# Altium schematic sheet CAN.SchDoc
size A; SheetNumber: 2; SheetTotal: 5
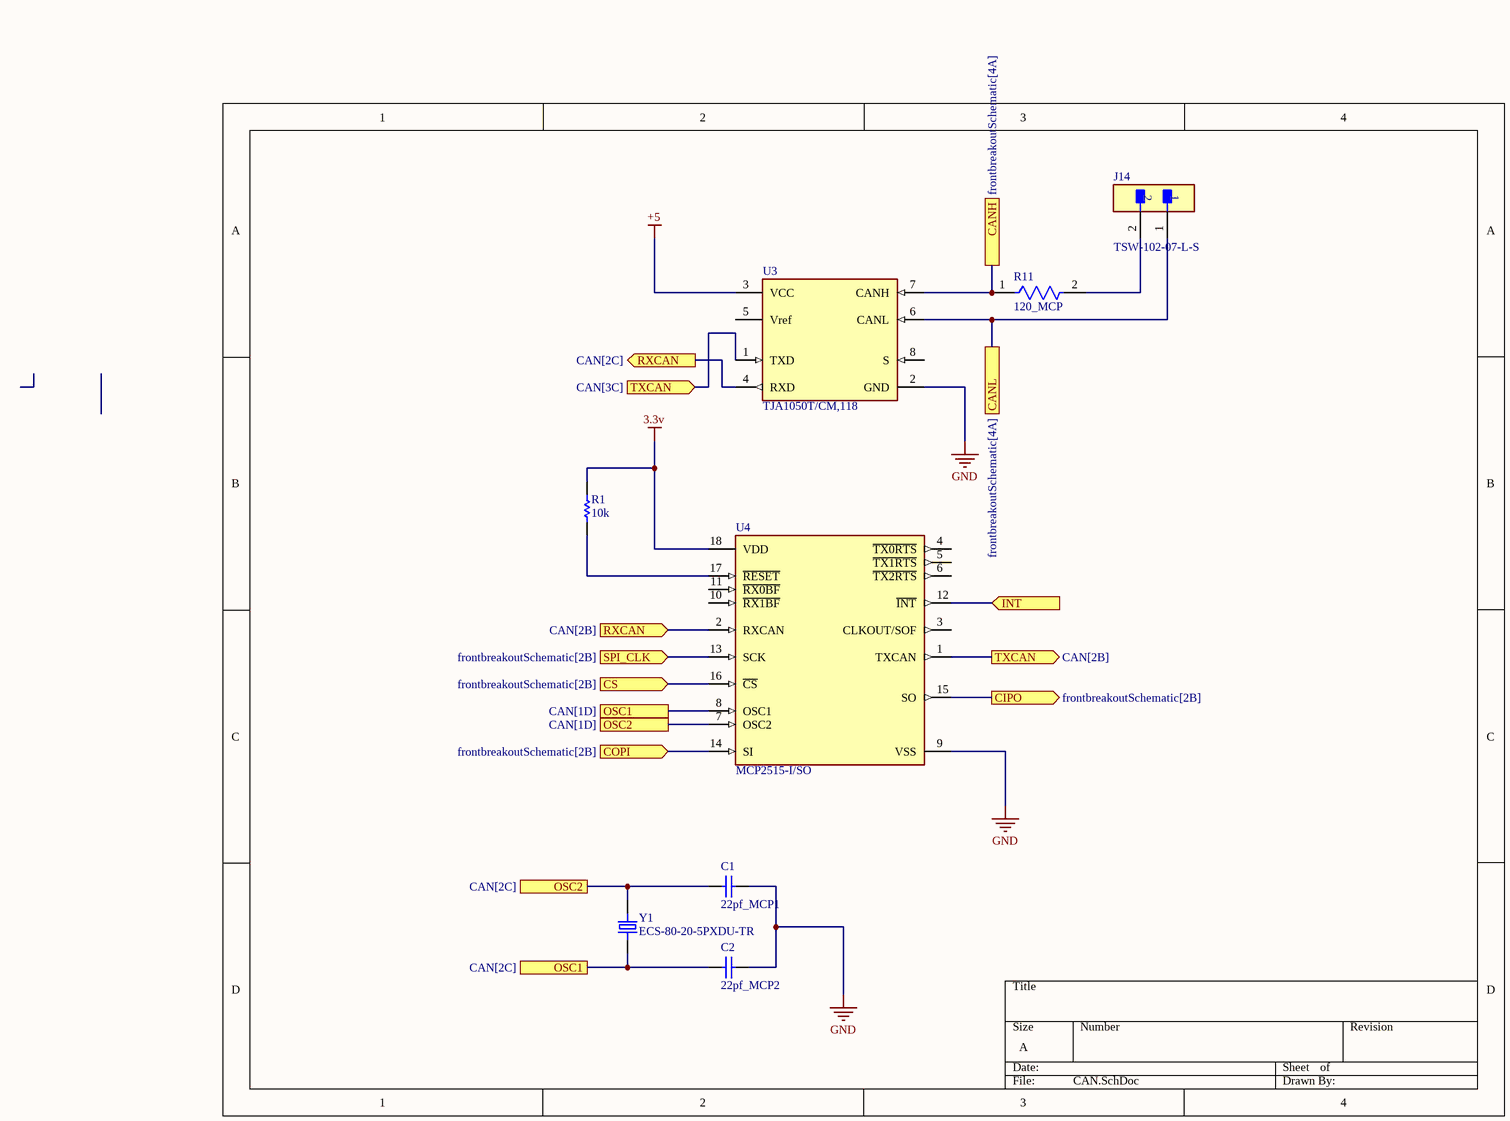
[diagram p0: CAN.SchDoc]

## Parts
C1  22pf_MCP1  [CAPC2013X145X50NL20T20]
C2  22pf_MCP2  [CAPC2013X145X50NL20T20]
J14  TSW-102-07-L-S  [FP-TSW-102-07-L-S-MFG]
R1  10k  [RESC3116X65X50NL20T20]
R11  120_MCP  [FP-CRCW0805-e3-IPC_C]
U3  TJA1050T/CM,118  [FP-SOT96-1-IPC_A]
U4  MCP2515-I/SO  [FP-C04-051-MFG]
Y1  ECS-80-20-5PXDU-TR  [XTAL_ECS-80-20-5PXDU-TR]

## Ports
CANH (see frontbreakoutSchematic[4A]), CANL (see frontbreakoutSchematic[4A]), CIPO (out, see frontbreakoutSchematic[2B]), COPI (in, see frontbreakoutSchematic[2B]), CS (in, see frontbreakoutSchematic[2B]), INT (in), OSC1 (see CAN[1D]), OSC1 (see CAN[2C]), OSC2 (see CAN[1D]), OSC2 (see CAN[2C]), RXCAN (in, see CAN[2B]), RXCAN (out, see CAN[2C]), SPI_CLK (in, see frontbreakoutSchematic[2B]), TXCAN (in, see CAN[3C]), TXCAN (out, see CAN[2B])

## Nets
3.3v: R1.2 U4.18(VDD)
+5: U3.3(VCC)
GND: C1.2 C2.2 U3.2(GND) U4.9(VSS)
CANH: R11.1 U3.7(CANH) ; port CANH
CANL: J14.1 U3.6(CANL) ; port CANL
CIPO: U4.15(SO) ; port CIPO
COPI: U4.14(SI) ; port COPI
CS: U4.16(~{CS}) ; port CS
INT: U4.12(~{INT}) ; port INT
OSC1: C2.1 U4.8(OSC1) Y1.1 ; port OSC1
OSC2: C1.1 U4.7(OSC2) Y1.2 ; port OSC2
RXCAN: U3.4(RXD) U4.2(RXCAN) ; port RXCAN
SPI_CLK: U4.13(SCK) ; port SPI_CLK
TXCAN: U3.1(TXD) U4.1(TXCAN) ; port TXCAN
NetJ14_2: J14.2 R11.2
NetR1_1: R1.1 U4.17(~{RESET})

Not connected (* = marked no-connect by the designer): U3 5(Vref) 8(S); U4 3(CLKOUT/SOF) 4(~{TX0RTS}) 5(~{TX1RTS}) 6(~{TX2RTS}) 10(~{RX1BF}) 11(~{RX0BF})

## Library data of the parts
C1 C2 = CMP-1036-01227-2: Manufacturer: Vitramon; Part Number: VJ0805A220GXXCW1BC
J14 = CMP-02766-001428-1: CONN HEADER VERT 2POS 2.54MM; Voltage Rating: 550V; Current Rating: 7.6A; Gender: Male; Number of Contacts: 2; Connector Type: Male Pin; Radiation Hardening: No; Orientation: Straight; Contact Plating: Gold; Max Operating Temperature: 125°C; Mount: Through Hole; Package Quantity: 1; Number of Rows: 1; Housing Material: Polyester; RoHS Compliant: Yes; Length: 5.08mm; Max Voltage Rating (AC): 550V; Pitch: 2.54mm; Packaging: Bulk; Depth: 2.54mm; Termination: Solder; Min Operating Temperature: -55°C; Housing Color: Black; Lead Free: Lead Free; Color: Black; Number of Positions: 2; Width: 2.54mm; Max Current Rating: 7.6A; REACH SVHC: No SVHC; Contact Material: Bronze; Contact Mating Length: 0.23inch; Series: TSW; Contact Type: Male Pin
R1 = CMP-2003-04883-1: CRCW120610K0FKEAHP; Manufacturer: Vishay Dale; Part Number: CRCW120610K0FKEAHP
R11 = CMP-02407-009256-1: RES Thick Film, 4.02Ω, 1%, 0.125W, 200ppm/°C, 0805; Resistance: 4.02R; Power Rating: 125mW; Voltage Rating: 150V; Features: Automotive AEC-Q200; Weight: 0.000194oz; Height: 0.02inch; Case Code (Metric): 2012; Composition: Thick Film; Temperature Coefficient: 200ppm/°C; Case/Package: 0805; Min Operating Temperature: -55°C; Width: 0.049inch; Contact Plating: Tin; Packaging: Tape and Reel; Tolerance: 1%; Length: 0.079inch; Lead Free: Lead Free; Case Code (Imperial): 0805; Package Quantity: 5000; Radiation Hardening: No; Max Operating Temperature: 155°C; Number of Terminations: 2; Max Power Dissipation: 125mW; Voltage Rating (DC): 150V
U3 = CMP-2000-04923-2: IC TRANSCEIVER HALF 1/1 8SO; Simplex/Duplex: Half Duplex; Max Supply Current: 10mA; Number of Receive Buffers: 1; Min Supply Voltage: 4.75V; Max Supply Voltage: 5.25V; Interface: CAN; Data Rate: 1Mbps; Receiver Hysteresis: 70mV; Number of Transmit Buffers: 1; Min Operating Temperature: -40°C; Case/Package: SO; REACH SVHC: No SVHC; Max Operating Temperature: 150°C; Number of Pins: 8; Lead Free: Lead Free; Number of Transceivers: 1; Packaging: Tape and Reel; Mount: Surface Mount; Radiation Hardening: No; Nominal Supply Current: 10mA; Package Quantity: 2500; Contact Plating: Gold
U4 = CMP-0186-00133-3: IC CAN CONTROLLER W/SPI 18SOIC; Manufacturer: Microchip; Min Supply Voltage: 2.7V; Max Supply Voltage: 5.5V; Standoff Height: 0.1mm; Nominal Supply Current: 10mA; Interface: SPI,CAN; Lead Free: Yes; Digikey Description: IC CAN CONTROLLER W/SPI 18SOIC; Category: IC; RoHS: TRUE; Manufacturer Part Number: MCP2515-I/SO; ComponentLink2URL: http://ww1.microchip.com/downloads/en/DeviceDoc/MCP2515-Stand-Alone-CAN-Controller-with-SPI-20001801J.pdf; Mouser Description: CAN Interface IC W/ SPI Interface; Device Class L2: Interface ICs; Package: C04-051; Automotive: No; Function: Controller; Octopart: https://octopart.com/mcp2515-i%2Fso-microchip-430187; Temperature: -40°C to +85°C; Ipc Land Pattern Name: SOIC127P1030X265-18; Ambient Temperature Range Low: -65°C; Height: 2.65mm; Device Class L1: Integrated Circuits (ICs); Ambient Temperature Range High: +125°C; Footprint Url: http://ww1.microchip.com/downloads/en/DeviceDoc/18L_SOIC_Wide_7.50_SO_C04-0051D.pdf; Temperature Range Low: -40°C; Device Class L3: Controllers; Temperature Range High: +85°C; ComponentLink2Description: Datasheet
Y1 = ECS-80-20-5PXDU-TR: 8MHz Â±30ppm Crystal 20pF 60 Ohms HC-49/US; MF: ECS Inc.; Package: HC49/US ECS International; Availability: Unavailable; Value: *; MP: ECS-80-20-5PXDU-TR; SnapEDA_Link: https://www.snapeda.com/parts/ECS-80-20-5PXDU-TR/ECS%20Inc./view-part/584052/?ref=snap; Price: None